# EAGLE design freeduino_V1.16-0603-WestfW (EAGLE 4.16)
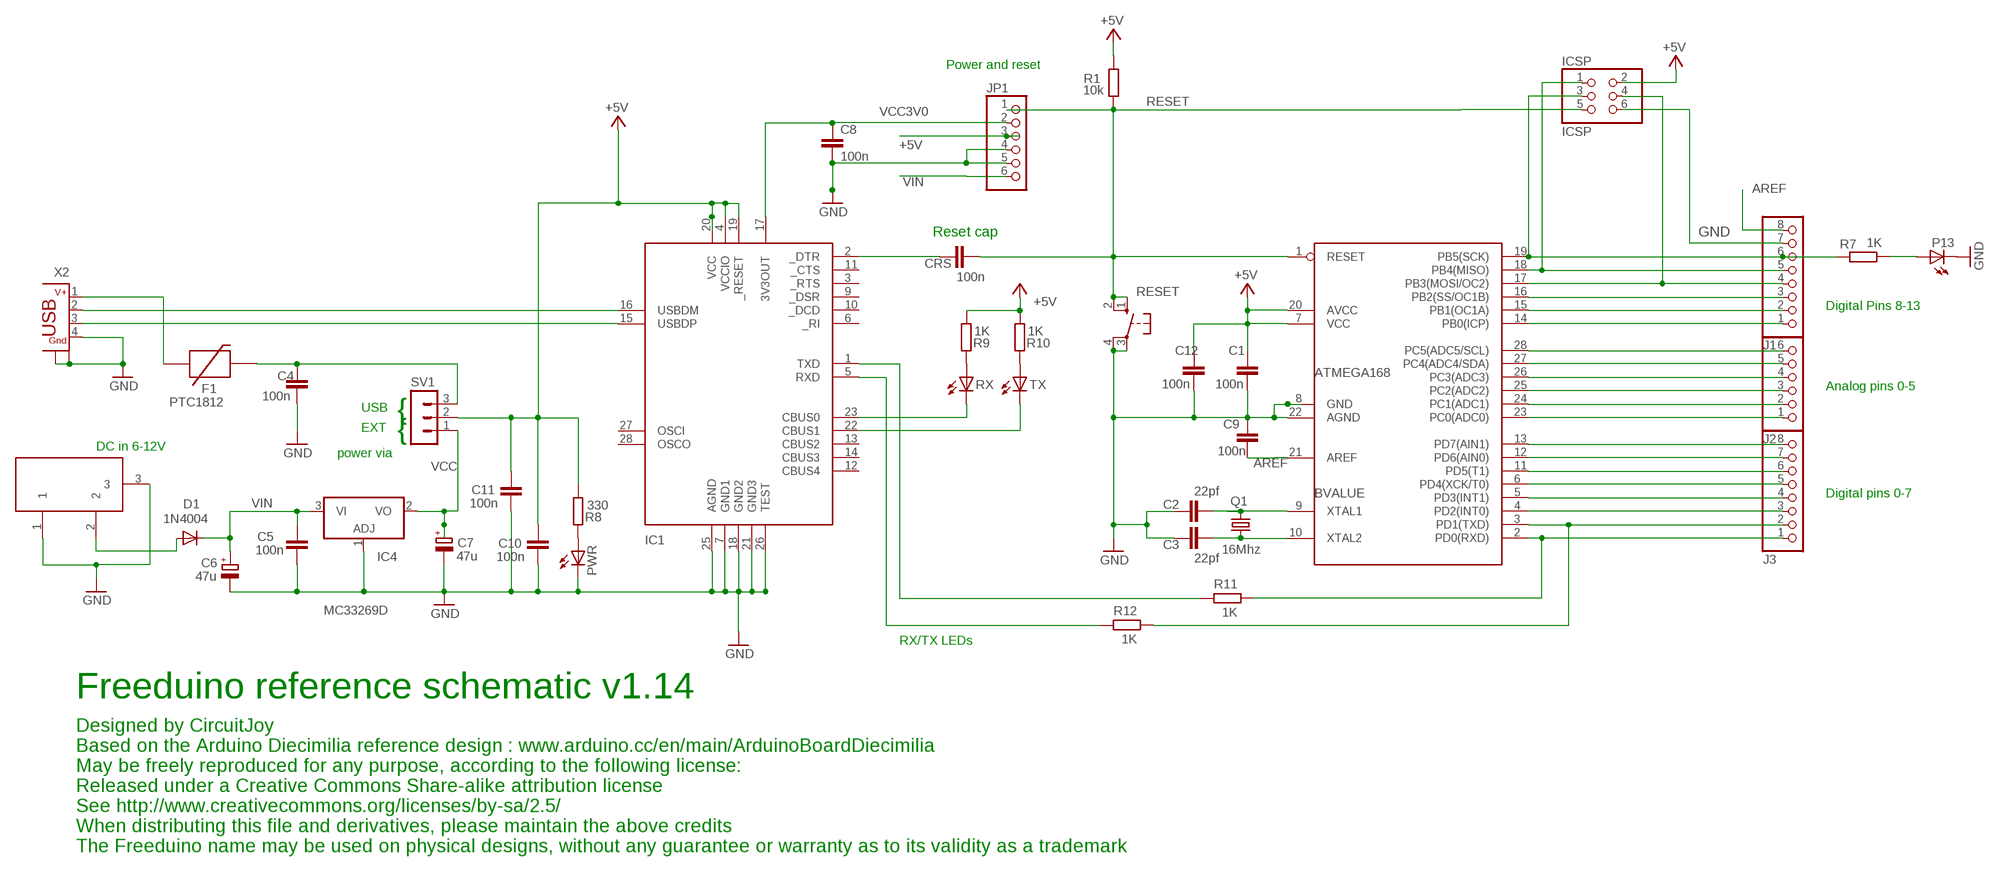
[diagram p0: schematic, sheet 1]

## Parts
BVALUE  ATMEGA168  MEGA8-P  [DIL28-3]
C1  100n  C-EUC0603  [C0603]
C2  22pf  C-EUC0603  [C0603]
C3  22pf  C-EUC0603  [C0603]
C4  100n  C-EUC0603  [C0603]
C5  100n  C-EUC0603  [C0603]
C6  47u  CPOL-EUD  [PANASONIC_D]
C7  47u  CPOL-EUD  [PANASONIC_D]
C8  100n  C-EUC0603  [C0603]
C9  100n  C-EUC0603  [C0603]
C10  100n  C-EUC0603  [C0603]
C11  100n  C-EUC1206  [C1206]
C12  100n  C-EUC0603  [C0603]
CRS  100n  C-EUC0603  [C0603]
D1  1N4004  DIODESMA  [SMA-DIODE]
DC1  9V in  DC21MMX  [DC-21MM]
F1  PTC1812  [C1812]
IC1  FT232RL  FT232RL-PINNED  [SSOP28DB]
IC4  MC33269D  [DPACK]
ICSP  ICSP  PINHD-2X3  [2X03]
J1  PINHD-1X8  [1X08]
J2  PINHD-1X6  [1X06]
J3  PINHD-1X8  [1X08]
JP1  PINHD-1X6  [1X06]
P13  LEDCHIPLED_0603  [CHIPLED_0603]
PWR  LEDCHIPLED_0603  [CHIPLED_0603]
Q1  16Mhz  CRYSTALHC49U-V  [HC49U-V]
R1  10k  R-EU_R0603  [R0603]
R7  1K  R-EU_R0603  [R0603]
R8  330  R-EU_R0603  [R0603]
R9  1K  R-EU_R0603  [R0603]
R10  1K  R-EU_R0603  [R0603]
R11  1K  R-EU_R0603  [R0603]
R12  1K  R-EU_R0603  [R0603]
RESET  10-XX  [B3F-10XX]
RX  LEDCHIPLED_0603  [CHIPLED_0603]
SV1  MA03-1  [MA03-1]
TX  LEDCHIPLED_0603  [CHIPLED_0603]
X2  CON-USB-B  [USB-WSHIELDPADS]

## Nets
+5V [power]: BVALUE.7(VCC) BVALUE.20(AVCC) C1.1 C10.2 C11.2 C12.1 IC1.4(VCCIO) IC1.19(_RESET) IC1.20(VCC) ICSP.2 JP1.3 R1.2 R8.1 R9.1 R10.1 SV1.2
AREF: BVALUE.21(AREF) C9.1 J1.8
GND [power]: BVALUE.8(GND) BVALUE.22(AGND) C1.2 C2.1 C3.1 C4.1 C5.1 C6.- C7.- C8.2 C9.2 C10.1 C11.1 C12.2 DC1.1 DC1.3 IC1.7(GND1) IC1.18(GND2) IC1.21(GND3) IC1.25(AGND) IC1.26(TEST) IC4.1(ADJ) ICSP.6 J1.7 JP1.4 JP1.5 P13.C PWR.C RESET.3(P) RESET.4(P1) X2.4 X2.SH1(GND) X2.SH2(GND)
M8RXD [finepitch]: IC1.1(TXD) R11.1
M8TXD [finepitch]: IC1.5(RXD) R12.1
N$2: BVALUE.15(PB1(OC1A)) J1.2
N$3: PWR.A R8.2
N$5 [finepitch]: IC1.23(CBUS0) RX.C
N$6: BVALUE.9(XTAL1) C2.2 Q1.2
N$7 [power]: C4.2 F1.2 SV1.3
N$8: D1.A DC1.2
N$9 [finepitch]: IC1.16(USBDM) X2.2
N$10: BVALUE.4(PD2(INT0)) J3.3
N$11: BVALUE.5(PD3(INT1)) J3.4
N$12: BVALUE.6(PD4(XCK/T0)) J3.5
N$13: BVALUE.11(PD5(T1)) J3.6
N$14: BVALUE.12(PD6(AIN0)) J3.7
N$15: BVALUE.13(PD7(AIN1)) J3.8
N$16: BVALUE.23(PC0(ADC0)) J2.1
N$17: BVALUE.24(PC1(ADC1)) J2.2
N$18: BVALUE.25(PC2(ADC2)) J2.3
N$19: BVALUE.26(PC3(ADC3)) J2.4
N$20: BVALUE.27(PC4(ADC4/SDA)) J2.5
N$21: BVALUE.28(PC5(ADC5/SCL)) J2.6
N$22: BVALUE.3(PD1(TXD)) J3.2 R12.2
N$23: BVALUE.16(PB2(SS/OC1B)) J1.3
N$24 [finepitch]: IC1.15(USBDP) X2.3
N$26: BVALUE.18(PB4(MISO)) ICSP.1 J1.5
N$27 [power]: F1.1 X2.1
N$28: BVALUE.14(PB0(ICP)) J1.1
N$29 [finepitch]: IC1.22(CBUS1) TX.C
N$31: BVALUE.10(XTAL2) C3.2 Q1.1
N$32: P13.A R7.1
N$34: R10.2 TX.A
N$36: R9.2 RX.A
N$37 [finepitch]: CRS.1 IC1.2(_DTR)
N$43: BVALUE.17(PB3(MOSI/OC2)) ICSP.4 J1.4
N$44: BVALUE.2(PD0(RXD)) J3.1 R11.2
RESET: BVALUE.1(RESET) CRS.2 ICSP.5 JP1.1 R1.1 RESET.1(S) RESET.2(S1)
SCK: BVALUE.19(PB5(SCK)) ICSP.3 J1.6 R7.2
VCC [power]: C7.+ IC4.2(VO) SV1.1
VCC3V0 [power]: C8.1 IC1.17(3V3OUT) JP1.2
VIN [power]: C5.2 C6.+ D1.C IC4.3(VI) JP1.6
Unconnected: IC1.3(_RTS) IC1.6(_RI) IC1.9(_DSR) IC1.10(_DCD) IC1.11(_CTS) IC1.12(CBUS4) IC1.13(CBUS2) IC1.14(CBUS3) IC1.27(OSCI) IC1.28(OSCO)

## Notes on the sheet
- Power and reset
- Reset cap
- Digital Pins 8-13
- Analog pins 0-5
- USB
- {
- EXT
- {
- DC in 6-12V
- power via
- Digital pins 0-7
- RX/TX LEDs
- Freeduino reference schematic v1.14
- Designed by CircuitJoy
- Based on the Arduino Diecimilia reference design : www.arduino.cc/en/main/ArduinoBoardDiecimilia
- May be freely reproduced for any purpose, according to the following license:
- Released under a Creative Commons Share-alike attribution license
- See http://www.creativecommons.org/licenses/by-sa/2.5/
- When distributing this file and derivatives, please maintain the above credits
- The Freeduino name may be used on physical designs, without any guarantee or warranty as to its validity as a trademark

## Library data of the parts
BVALUE = my-library:MEGA8-P: MICROCONTROLLER 8 Kbytes FLASH 1 kbytes SRAM 512 bytes EEPROM USART 4-channel 10 bit ADC 2-channel 8 bit ADC Source: avr.lbr
C1-C5 C8-C12 CRS = rcl:C-EU: CAPACITOR, European symbol
C6 C7 = rcl:CPOL-EU: POLARIZED CAPACITOR, European symbol
D1 = SparkFunEagle-6-6-07:DIODE: Diode These are standard reverse protection diodes and small signal diodes. SMA package can handle up to about 1A. SOD-323 can handle about 200mA. What the SOD-323 package when ordering, there are some mfgs out there that are 5-pin packages.
DC1 = powersupply:DC21MM
F1 = SparkFunEagle-6-6-07:PTC: Resettable Fuse PTC Resettable Fuse. Spark Fun Electronics SKU : COM-08357
IC1 = my-library:FT232RL-PINNED: USB UART FT232RL 4th Generation USB UART (USB <-> Serial) Controller. Spark Fun Electronics SKU : COM-00650
IC4 = linear:MC33269?*: Adjustable Output Low Dropout Voltage Regulator 800 mA Source: http://www.onsemi.com/pub/Collateral/MC33269-D.PDF
ICSP = pinhead:PINHD-2X3: PIN HEADER
J1 J3 = pinhead:PINHD-1X8: PIN HEADER
J2 JP1 = pinhead:PINHD-1X6: PIN HEADER
P13 PWR RX TX = led:LED: LED OSRAM: - CHIPLED LG R971, LG N971, LY N971, LG Q971, LY Q971, LO R971, LY R971 LH N974, LH R974 LS Q976, LO Q976, LY Q976 LO Q996 - Hyper CHIPLED LW Q18S LB Q993, LB Q99A, LB R99A - SideLED LS A670, LO A670, LY A670, LG A670, LP A670 LB A673, LV A673, LT A673, LW A673 LH A674 LY A675 LS A676, LA A676, LO A676, LY A676, LW A676 LS A679, LY A679, LG A679 - Hyper Micro SIDELED® LS Y876, LA Y876, LO Y876, LY Y876 LT Y87S - SmartLED LW L88C, LW L88S LB L89C, LB L89S, LG L890 LS L89K, LO L89K, LY L89K LS L896, LA L896, LO L896, LY L896 - TOPLED LS T670, LO T670, LY T670, LG T670, LP T670 LSG T670, LSP T670, LSY T670, LOP T670, LYG T670 LG T671, LOG T671, LSG T671 LB T673, LV T673, LT T673, LW T673 LH T674 LS T676, LA T676, LO T676, LY T676, LB T676, LH T676, LSB T676, LW T676 LB T67C, LV T67C, LT T67C, LS T67K, LO T67K, LY T67K, LW E67C LS E67B, LA E67B, LO E67B, LY E67B, LB E67C, LV E67C, LT E67C LW T67C LS T679, LY T679, LG T679 LS T770, LO T770, LY T770, LG T770, LP T770 LB T773, LV T773, LT T773, LW T773 LH T774 LS E675, LA E675, LY E675, LS T675 LS T776, LA T776, LO T776, LY T776, LB T776 LHGB T686 LT T68C, LB T68C - Hyper Mini TOPLED® LB M676 - Mini TOPLED Santana® LG M470 LS M47K, LO M47K, LY M47K Source: http://www.osram.convergy.de/
Q1 = crystal:CRYSTAL: CRYSTAL
R1 R7-R12 = rcl:R-EU_: RESISTOR, European symbol
RESET = switch-omron:10-XX: OMRON SWITCH
SV1 = con-lstb:MA03-1: PIN HEADER
X2 = mylib4:CON-USB-B: BERG USB connector

## Net classes
0 default: width 0.254 mm, drill 0.203 mm
1 power: width 0.508 mm, drill 0.305 mm
2 finepitch: width 0.203 mm, drill 0.203 mm

## Board
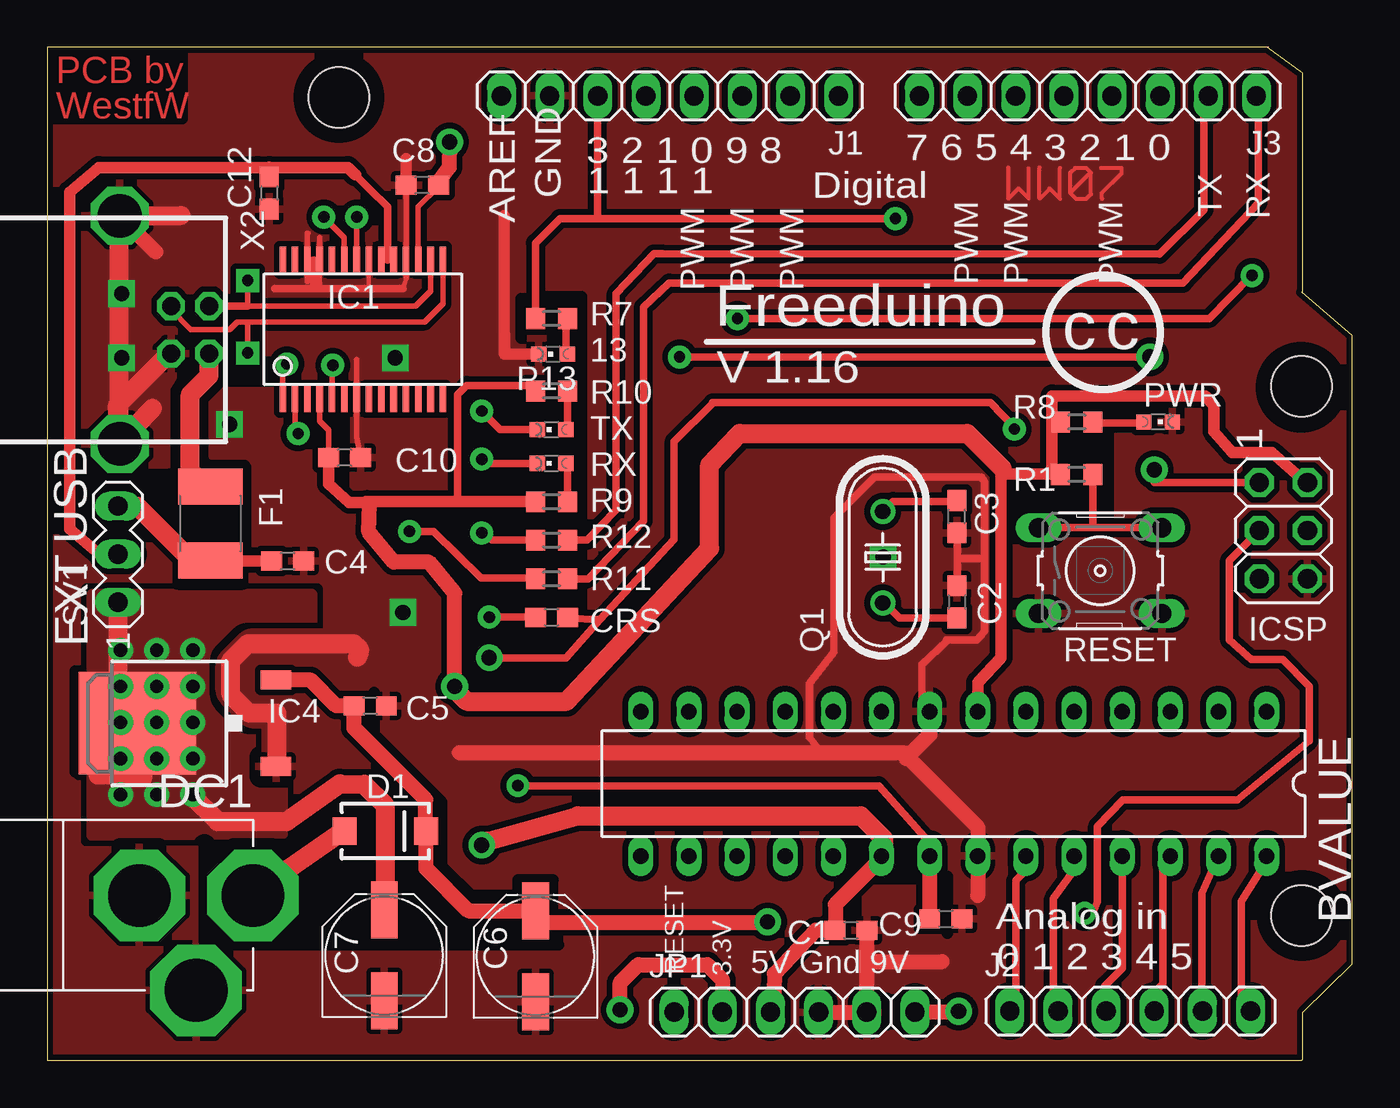
[diagram p1: board, top side]
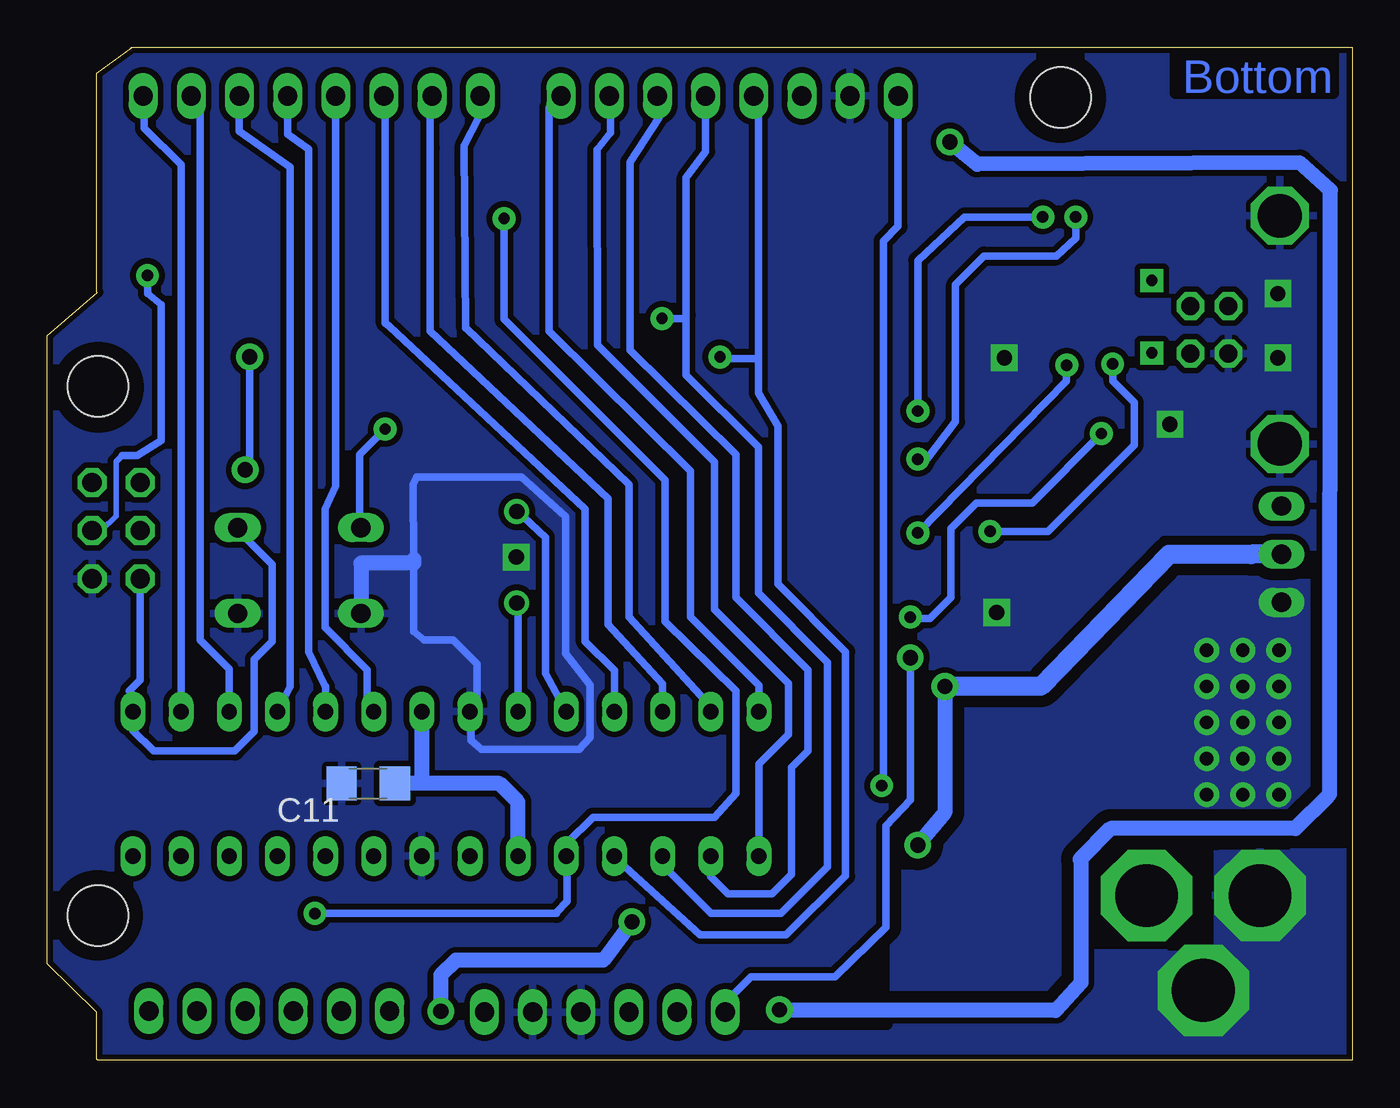
[diagram p2: board, bottom side, seen from below]

Size 68.83 x 53.43 mm. Coordinates in mm from the lower left corner, seen from the top.
Outline: 66.2,0.04 66.22,0.05 66.22,2.54 68.83,5.09
Outline: 66.22,40.53 66.22,52.08 64.39,53.43
Outline: 66.21,0.05 66.18,0 63.63,0 0,0 0,53.43 64.44,53.43
Outline: 68.83,5.1 68.83,38.23 66.17,40.53
Copper layers (1*16): Top 0.035mm / dielectric 1.5mm / Bottom 0.035mm
Design rules "default": minimum track width 10mil, minimum drill 0.6mm, track to track 8mil, track to pad 8mil, pad to pad 8mil, via to via 12mil, smd to smd 8mil, copper to edge 10mil, drill to drill 15mil, minimum pad ring 10mil, minimum via ring 12mil, stop-mask expansion 4mil, vias tented up to drill 0mil, thermal gap 10mil
Holes 3.2 mm at 66.17,35.56 66.17,7.62 15.37,50.8
tRestrict: area 64.2,33.5 to 68.1,37.5; area 64.2,5.6 to 68.2,9.6; area 13.4,48.8 to 17.4,52.8; 35 lines
bRestrict: area 64.2,5.7 to 68.2,9.6; area 64.1,33.5 to 68.1,37.5; area 13.4,48.8 to 17.4,52.8; area 13.4,48.8 to 17.4,52.8; 6 lines

### Footprints (pad centres in the part's own frame; a part is rotated, then mirrored left to right if it is on the bottom)
DIL28-3 = drill 0.813 long: 1 -16.51,-3.81; 2 -13.97,-3.81; 3 -11.43,-3.81; 4 -8.89,-3.81; 5 -6.35,-3.81; 6 -3.81,-3.81; 7 -1.27,-3.81; 8 1.27,-3.81; 9 3.81,-3.81; 10 6.35,-3.81; 11 8.89,-3.81; 12 11.43,-3.81; 13 13.97,-3.81; 14 16.51,-3.81; 15 16.51,3.81; 16 13.97,3.81; 17 11.43,3.81; 18 8.89,3.81; 19 6.35,3.81; 20 3.81,3.81; 21 1.27,3.81; 22 -1.27,3.81; 23 -3.81,3.81; 24 -6.35,3.81; 25 -8.89,3.81; 26 -11.43,3.81; 27 -13.97,3.81; 28 -16.51,3.81
C0603 = smd 1.1 x 1: 1 -0.85,0; 2 0.85,0
PANASONIC_D = smd 3 x 1.4: + 2.4,0; - -2.4,0
C1206 = smd 1.6 x 1.8: 1 -1.4,0; 2 1.4,0
SMA-DIODE = smd 1.27 x 1.47: A -2.15,0; C 2.15,0
DC-21MM = drill 3.302 pad 4.826 octagon: 1 -5.08,-3.353; 2 -0.076,-6.35; 3 -0.076,-0.356
C1812 = smd 1.9 x 3.4: 1 -1.95,0; 2 1.95,0
SSOP28DB = smd 0.348 x 1.397: 1 -4.225,-3.656; 2 -3.575,-3.656; 3 -2.925,-3.656; 4 -2.275,-3.656; 5 -1.625,-3.656; 6 -0.975,-3.656; 7 -0.325,-3.656; 8 0.325,-3.656; 9 0.975,-3.656; 10 1.625,-3.656; 11 2.275,-3.656; 12 2.925,-3.656; 13 3.575,-3.656; 14 4.225,-3.656; 15 4.225,3.656; 16 3.575,3.656; 17 2.925,3.656; 18 2.275,3.656; 19 1.625,3.656; 20 0.975,3.656; 21 0.325,3.656; 22 -0.325,3.656; 23 -0.975,3.656; 24 -1.625,3.656; 25 -2.275,3.656; 26 -2.925,3.656; 27 -3.575,3.656; 28 -4.225,3.656
DPACK = smd 1 x 1.6: 1 -2.28,-4.8; 3 2.28,-4.8 | smd 5.4 x 6.2: 2 0,2.5
2X03 = drill 1.016 octagon: 1 -2.54,-1.27; 2 -2.54,1.27; 3 0,-1.27; 4 0,1.27; 5 2.54,-1.27; 6 2.54,1.27
1X08 = drill 1.016 long: 1 -8.89,0; 2 -6.35,0; 3 -3.81,0; 4 -1.27,0; 5 1.27,0; 6 3.81,0; 7 6.35,0; 8 8.89,0
1X06 = drill 1.016 long: 1 -6.35,0; 2 -3.81,0; 3 -1.27,0; 4 1.27,0; 5 3.81,0; 6 6.35,0
CHIPLED_0603 = smd 0.8 x 0.8: A 0,-0.75; C 0,0.75
HC49U-V = drill 0.813 round: 1 -2.413,0; 2 2.413,0
R0603 = smd 1 x 1.1: 1 -0.85,0; 2 0.85,0
B3F-10XX = drill 1.016 long: 1 -3.251,2.261; 2 3.251,2.261; 3 -3.251,-2.261; 4 3.251,-2.261
MA03-1 = drill 1.016 long: 1 -2.54,0; 2 0,0; 3 2.54,0
USB-WSHIELDPADS = drill 0.95 octagon: 1 1.25,4.71; 2 -1.25,4.71; 3 -1.25,2.71; 4 1.25,2.71 | drill 2.3 octagon: SH1 -6.02,0; SH2 6.02,0

### Placement (x,y rotation side)
BVALUE  47.81,14.58 180 top
C1  42.39,6.86 0 top
C2  47.97,24.18 270 top
C3  47.98,28.67 90 top
C4  12.67,26.33 180 top
C5  17.03,18.7 180 top
C6  25.75,5.48 90 top
C7  17.77,5.52 90 top
C8  19.78,46.16 180 top
C9  47.39,7.46 0 top
C10  15.68,31.79 180 top
C11  51.9,14.6 0 bottom
C12  11.7,45.75 270 top
CRS  26.59,23.37 0 top
D1  17.82,12.09 0 top
DC1  4.49,8.76 90 top
F1  8.6,28.31 270 top
IC1  16.64,38.56 0 top
IC4  7.26,17.77 90 top
ICSP  65.2,27.94 270 top
J1  32.84,50.87 180 top
J2  57.12,2.59 0 top
J3  54.89,50.87 180 top
JP1  39.42,2.54 0 top
P13  26.67,37.26 90 top
PWR  58.59,33.67 270 top
Q1  44.07,26.53 270 top
R1  54.3,30.91 180 top
R7  26.59,39.13 180 top
R8  54.3,33.67 0 top
R9  26.59,29.46 0 top
R10  26.59,35.3 0 top
R11  26.59,25.4 0 top
R12  26.59,27.43 0 top
RESET  55.54,25.83 0 top
RX  26.59,31.49 90 top
SV1  3.72,26.69 90 top
TX  26.59,33.27 90 top
U$3  [CC-LOGO]  56.58,39 0 top
X2  3.81,38.53 270 top

### Tracks (layer width: path | path; a pad name or v marks a point on that pad's centre or on a via)
+5V  (via drill 0.8)
  Top 0.25: 17.95,42.22 18.2,42.22 18.23,42.25 IC1.19 17.95,42.22 | 17.95,42.22 IC1.20 | 17.04,45.91
  Top 0.3: IC1.4 14.36,33.71 14.85,33.23 14.85,31.72 14.83,31.73 C10.2 14.87,31.79 14.93,31.74 14.83,31.74
  Top 0.4: R10.1 25.77,35.3 25.47,35.6 22.12,35.6 21.64,35.12 21.64,29.48 21.72,29.56 22.12,29.56 22.12,29.46 | 17.95,42.22 17.95,45.04 17.04,45.91 16.24,46.71
  Top 0.6: 16.25,46.71 16.24,46.71 15.86,47.09 11.7,47.09 | 16.92,29.46 16.8,29.46 | 16.92,29.46 22.12,29.46 R9.1 | 49.08,19.77 BVALUE.7 | 49.08,19.77 49.08,19.93 50.31,21.23 50.31,30.91 | 52.99,30.91 53.18,30.91 | 52.99,30.91 52.99,33.77 | 52.99,33.77 52.99,35.04 61.08,35.04 61.54,34.57 61.54,33.17 62.5,32.06 64.6,32.06 65.89,30.92 ICSP.2 | R8.1 53.35,33.77 52.99,33.77 | 53.18,30.91 53.19,30.91 | 53.18,30.91 53.01,31.08 | 49.08,19.77 49.08,19.75 | 50.37,31.22 50.31,30.91 | 50.31,30.91 52.99,30.91 | 52.99,30.91 R1.2 | 11.1,47.09 11.7,47.09 | 11.1,47.09 11.08,47.09 11.07,47.08 | 14.83,31.82 14.83,31.74 14.83,30.4 15.92,29.43 16.94,29.43 | 16.92,29.46 16.92,29.47 16.94,29.43 | 17,29.31 16.94,29.37 16.94,29.43 | 17,29.35 17,29.31 | 17,29.31 | 11.7,47.09 11.7,47.11 C12.1 | 11.1,47.09 2.72,47.09 1.17,45.8 1.17,28.01 2.74,26.7 3.67,26.7 3.72,26.65 | 3.72,26.65 3.73,26.64 | SV1.2 3.72,26.65
  Top 0.8: JP1.3 38.15,2.5 38.31,2.65 38.35,4.56 40.53,6.86 C1.1 41.54,6.89 41.4,7.02 41.56,7.18 41.56,8.21 44,10.65 BVALUE.20 44,10.8 44.1,10.91 | 17,29.35 16.96,27.87 18.27,26.28 18.29,26.27 20.13,26.27 21.48,24.64 v21.48,19.72 21.48,19.56 | R1.2
  Top 1: v22.91,11.35 23.19,11.54 27.99,12.89 42.91,12.89 44.1,11.7 44.1,10.91 | 21.48,19.56 22.12,18.93 27.4,18.93 34.93,27 34.93,31.4 36.52,33.07 48.52,33.07 50.37,31.22
  Bottom 0.8: v22.91,11.35 v22.92,11.35 21.48,13.05 v21.48,19.72 | C11.2 44.98,14.6 44,13.61 44,10.79 43.97,10.77 | 43.97,10.77 43.96,10.75 | BVALUE.20 43.97,10.77 | BVALUE.7 49.08,14.61
  Bottom 1: v21.48,19.72 21.46,19.72 21.45,19.73 16.42,19.73 9.66,26.69 5.34,26.68 5.33,26.67 5.31,26.69 SV1.2
AREF  (via drill 0.6)
  Top 0.4: v24.82,14.48 43.87,14.48 46.48,11.54 46.48,10.75 46.54,10.7 | 46.54,10.7 46.56,10.67 | 46.54,10.7 BVALUE.21
  Top 0.8: 46.54,10.89 46.54,10.88 BVALUE.21 | 46.54,10.89 C9.1 | 46.54,10.89 46.56,10.91
  Bottom 0.4: J1.8 23.95,44 24.74,43.22 24.74,14.56 v24.82,14.48 | v24.82,14.48 24.97,14.56 | v24.82,14.48
GND  (via drill 0.8)
  Top 0.2: 50.69,47.11 50.69,45.47 50.72,45.47 51.23,45.98 51.25,45.98 51.77,45.46 51.77,47.06 | 52.33,47.09 52.33,45.46 52.34,45.46 52.36,45.46 52.88,45.98 53.41,45.44 53.41,47.06 53.42,47.07 | 53.97,46.82 54.22,47.07 54.8,47.07 55.05,46.82 55.05,45.69 55.04,45.69 54.8,45.44 54.29,45.44 54.28,45.43 54.27,45.43 53.96,45.74 53.96,46.82 | 53.96,45.76 55.03,46.83 | 55.58,47.07 56.67,47.07 56.67,46.79 55.64,45.76 55.64,45.45 55.65,45.44
  Top 0.25: IC1.7 16.31,35.08 16.31,35.09 | 13.71,42.24 13.71,42.25 | 13.71,42.24 IC1.26 14.05,42.22 | 14.05,42.22 13.74,42.22 13.71,42.24 | 14.05,42.22 14.34,42.22 IC1.25 | 18.78,40.7 18.91,41.23 | IC1.21 16.96,40.7 | 18.91,46.18 C8.2 18.88,46.16 18.85,46.13 18.91,46.06 18.91,46.18 | 18.91,46.18 18.86,46.23 | 14.36,43.39 14.34,43.39 | 13.71,43.63 13.79,43.63
  Top 0.3: C10.1 16.3,32.87 16.31,32.88 16.31,35.09 | IC1.7 16.31,36.96 | 18.91,41.23 IC1.18 18.91,46.06 | IC1.25 14.36,43.39 | 13.71,43.63 IC1.26 13.71,41.08 13.73,41.08 | 14.34,42.22 14.34,41 14.35,41
  Top 0.4: 11.98,40.7 14.05,40.7 | 14.05,40.7 16.96,40.7 18.78,40.7 | 14.05,40.7 14.05,42.22 | C3.1 48.01,27.66 47.99,27.66 47.99,25.05 | 47.99,25.05 C2.1 | 49.42,26.47 49.42,30.52 49.26,30.75 43.63,30.75 41.48,28.61 41.48,21.55 40.21,19.88 40.21,17.02 40.69,16.39 45.85,16.39 | 49.42,26.47 49.42,22.62 49.02,22.18 47.44,22.18 47.44,22.09 46.14,20.88 46.14,18.97 46.53,18.39 BVALUE.8 | 45.85,16.39 46.01,16.39 46.56,16.94 46.56,18.29 46.56,18.45 | 47.99,25.05 47.99,26.47 49.42,26.47 | 45.77,16.55 45.85,16.55 45.85,16.39
  Top 0.6: P13.C 24.11,37.26 24.1,39.48 24.1,44.56 | 18.91,46.06 18.91,47.55 | JP1.5 43.35,2.54
  Top 0.8: 49.08,8.69 BVALUE.22 49.08,12.29 45.37,15.99 | 44.5,5.19 43.23,5.27 43.23,5.19 | 44.5,5.19 47.2,5.19 | 43.23,5.19 43.23,2.65 43.31,2.58 43.27,2.54 JP1.5 43.11,2.54 43.07,2.58 43.03,2.54 JP1.4 | 43.23,5.19 44.5,5.19 | C1.2 43.24,6.38 43.23,5.19 | 21.72,16.23 45.14,16.23 45.37,15.99 | 45.37,15.99 45.29,15.91 | 45.37,15.99 | 46.56,18.29 46.56,17.18 45.37,15.99 | 3.79,44.56 5.73,42.63
  Top 1: 6.49,37.32 6.48,37.33 3.69,34.54 3.81,32.58 | X2.SH2 3.81,32.58 | 3.79,32.57 3.79,44.56 | 3.79,44.56 3.67,44.56 | 3.79,44.56 7.04,44.56 | 16.34,21.26 16.46,21.58 16.46,21.68 16.16,21.98 10.58,21.98 9.67,21.06 9.67,19.27 10.64,18.3 12.12,18.3 12.12,15.49 IC4.1 | 3.81,32.58 5.55,34.39
  Bottom 0.4: BVALUE.8 46.54,18.64 46.17,19.01 46.17,20.91 47.44,22.18 48.95,22.18 49.5,22.62 49.5,26.44 49.54,30.36 49.34,30.75 43.83,30.75 41.48,28.69 41.48,21.47 40.21,19.8 40.21,17.02 40.77,16.39 45.93,16.39 46.48,16.86 46.48,18.29 46.56,18.37 46.72,18.37
  Bottom 0.8: RESET.3 52.29,26.23 49.5,26.23 49.5,26.44
  other vias: 44.09,26.54 3.91,40.44 3.91,37.05 18.75,23.61 18.35,37.05 9.61,33.55
  pour Top (isolate 0.305, rank 4): -0.9,54.8 -0.9,-1 70.46,-1 70.46,54.57 -0.9,54.57
  pour Bottom (isolate 0.305, rank 4): -7.05,54.37 -7.01,-0.44 69.82,-0.44 69.82,54.57 -7.01,54.61
  pour Bottom (isolate 0.4, rank 6, no thermals): -1.81,11.42 14.29,11.42 14.29,-1.51 -1.62,-1.51 -1.62,11.38
M8RXD  (via drill 0.6)
  Top 0.25: 25.69,25.44 25.73,25.4 R11.1
  Top 0.3: IC1.1 12.42,36.4 v12.64,36.73
  Top 0.4: v19.1,27.9 19.58,27.9 20.37,27.9 22.87,25.44 25.69,25.44
  Bottom 0.4: v19.1,27.9 16.06,27.9 11.5,32.45 11.5,34.7 12.62,35.82 12.62,36.68 12.64,36.7 v12.64,36.73
M8TXD  (via drill 0.6)
  Top 0.3: v15.05,36.67 15.07,36.66 15.01,36.61 IC1.5
  Top 0.4: R12.1 23.46,27.43 v22.91,27.82
  Bottom 0.4: v22.91,27.82 v22.91,27.81 15.07,35.82 15.07,36.67 v15.05,36.67
N$2
  Bottom 0.4: BVALUE.15 31.3,15.62 29.74,17.18 29.74,19.88 33.63,23.77 33.63,31.55 39.82,37.74 39.84,48.04 39.12,48.93 39.15,50.87 J1.2 39.14,50.87 39.14,50.88
N$3
  Top 0.4: R8.2 55.37,33.61 57.84,33.61 PWR.A
N$5  (via drill 0.6)
  Top 0.25: 25.82,31.47 RX.C | v22.91,31.71 23.15,31.47
  Top 0.3: IC1.23 15.66,43.4 v14.58,44.49
  Top 0.4: 23.15,31.47 25.82,31.47
  Bottom 0.25: v14.58,44.49
  Bottom 0.4: v22.91,31.71 22.43,31.71 20.93,33.69 20.93,40.91 19.42,42.42 15.61,42.42 14.58,43.37 v14.58,44.49
N$6
  Top 0.4: Q1.2 44.07,24.13 44.1,24.17 44.94,23.33 C2.2
  Bottom 0.4: 44.07,24.17 44.1,24.17 | 44.07,24.17 Q1.2 | BVALUE.9 44,24.17 44.07,24.17
N$7
  Top 0.6: F1.2 8.63,26.37 8.67,26.32 8.68,26.33 C4.2
  Top 1: 3.42,29.07 3.58,29.23 SV1.3 4.75,29.23 7.6,26.38 8.53,26.38 8.55,26.37 F1.2
N$8
  Top 1: D1.A 15.59,12.09 10.84,8.81 DC1.2
N$9  (via drill 0.6)
  Top 0.3: 18.59,39.78 10.56,39.78 v10.56,41.14 | 18.59,39.78 18.67,39.78 | IC1.16 20.21,40.57 19.42,39.78 18.59,39.78
  Top 0.4: 8.44,39.78 8.41,39.8 | X2.2 8.44,39.78 | 10.56,39.78 8.44,39.78
N$10
  Bottom 0.4: J3.3 58.7,49 56.01,47.1 56.01,19.72 56.67,18.41 56.66,18.42 56.64,18.43 BVALUE.4
N$11
  Bottom 0.4: J3.4 56.16,48.84 55.06,48.06 55.05,21.54 54.18,19.72 54.17,19.72 54.16,19.73 54.16,19.72 BVALUE.5
N$12
  Bottom 0.4: J3.5 53.62,30.29 54.18,29.09 54.18,22.82 51.96,20.59 51.96,19.01 51.97,19.01 | 51.97,19.01 51.98,19.01 | BVALUE.6 51.62,18.37 51.97,19.01
N$13
  Bottom 0.4: BVALUE.11 38.92,20.57 40.45,22.1 40.45,29.09 50.81,38.73 51.01,38.89 51.01,50.76 51.08,50.83 J3.6
N$14
  Bottom 0.4: BVALUE.12 36.38,19.85 39.26,22.97 39.26,29.64 48.63,38.45 48.63,48.14 48.63,49.88 48.55,50.91 48.55,50.84 | 48.54,50.91 J3.7 48.54,50.84 48.55,50.84 | 48.55,50.84
N$15
  Bottom 0.4: BVALUE.13 33.84,18.66 38.15,23.37 38.15,30.36 46.76,38.65 46.76,38.61 46.84,48.26 46.09,49.72 46.09,50.68 46.08,50.69 J3.8
N$16
  Top 0.4: BVALUE.23 51.62,10.01 51.09,9.48 51.09,2.97 50.7,2.59 J2.1
  Top 0.8: 50.7,2.59 50.69,2.58
N$17
  Top 0.4: BVALUE.24 54.16,10.01 53.07,8.53 53.07,2.73 53.32,2.59 J2.2
N$18
  Top 0.4: BVALUE.25 56.7,4.85 55.77,3.92 55.77,2.89 55.85,2.81 J2.3
N$19
  Top 0.4: BVALUE.26 58.84,10.37 58.84,4.02 58.36,3.54 58.36,2.58
  Top 0.6: 58.36,2.58 J2.4
N$20
  Top 0.4: BVALUE.27 61.86,10.85 61.54,10.23 60.91,8.8 60.91,2.58
  Top 0.6: 60.91,2.58 J2.5
N$21
  Top 0.4: BVALUE.28 64.32,10.51 62.97,8.37 62.97,2.43 63.45,2.59
  Top 0.6: 63.45,2.59 J2.6
N$22
  Top 0.4: R12.2 28.48,27.43 30.01,29.02 30.01,40.44 31.99,42.54 32.44,42.54 58.66,42.52 61.01,44.85 61.01,50.44 J3.2 61.24,50.84 J3.2
  Bottom 0.4: BVALUE.3 59.24,20.65 60.77,22.18 60.77,50.36 61.29,50.87 | 61.29,50.87 J3.2 | J3.2 61.29,50.87
N$23
  Bottom 0.4: BVALUE.16 33.84,9.69 32.91,8.77 30.61,8.77 29.58,9.8 29.58,15.43 28.7,16.31 28.7,20.59 32.51,24.4 32.51,31.94 38.09,37.46 38.09,47.38 36.56,49.72 36.56,50.68 J1.3
N$24  (via drill 0.6)
  Top 0.3: IC1.15 20.86,39.91 19.9,38.94 10.56,38.94 | 10.56,38.94 10.02,38.94 9.62,38.54 7.55,38.54 6.48,39.66 6.49,39.68 6.49,39.71 | 10.56,38.94 v10.56,37.31
  Top 0.4: 6.49,39.68 6.48,39.68 6.48,39.74 X2.3
N$26  (via drill 0.6, 0.8)
  Top 0.4: ICSP.1 58.39,30.48 v58.39,31.15 | v33.35,37.1 v58.15,37.1
  Bottom 0.4: v58.39,31.15 58.15,31.15 v58.15,37.1 | BVALUE.18 38.92,10.73 34.4,6.62 29.86,6.62 26.72,9.72 26.72,21.55 30.29,25.12 30.29,33.45 31.32,35.2 31.32,37.02 | J1.5 31.52,50.87 31.4,50.76 31.32,50.12 31.32,37.02 | v33.35,37.1 33.55,37.02 31.32,37.02
N$27
  Top 1: X2.1 8.52,36.11 7.54,35.12 7.54,31.08 8.41,30.2 8.47,30.27 F1.1
N$28
  Bottom 0.4: BVALUE.14 31.3,19.77 34.9,23.37 34.9,31.07 42.36,38.47 42.36,50.26 41.73,50.91 | 41.73,50.91 41.72,50.91 | 41.73,50.91 J1.1
N$29  (via drill 0.6)
  Top 0.25: 16.32,42.18 16.31,42.19 IC1.22
  Top 0.3: 16.32,42.18 v16.32,44.49
  Top 0.4: TX.C 23.89,33.27 v22.91,34.25
  Bottom 0.4: v22.91,34.25 22.91,42.18 20.45,44.49 16.48,44.49 v16.32,44.49
N$31
  Top 0.4: 48.21,29.48 48.23,29.48 | 48.21,29.48 C3.2 | Q1.1 44.61,29.48 48.21,29.48
  Bottom 0.4: BVALUE.10 42.56,20.4 42.56,27.58 44.1,29.01 44.1,28.91 Q1.1
N$32
  Top 0.4: R7.1 27.43,39.01 27.36,38.93 27.36,37.19 | 27.36,37.19 27.36,37.18 | P13.A 27.36,37.19
N$34
  Top 0.4: TX.A 27.4,33.21 27.43,33.21 R10.2
N$36
  Top 0.4: R9.2 27.43,31.4 RX.A
N$37  (via drill 0.6)
  Top 0.25: CRS.1 arc-90 CRS.1 | 13.07,35.04 IC1.2
  Top 0.3: v13.23,33.06 13.07,33.35 IC1.2
  Top 0.4: v23.31,23.37 CRS.1
  Bottom 0.4: v13.23,33.06 16.88,29.4 19.81,29.4 21.16,28.05 21.16,24.4 22.28,23.29 23.31,23.29 v23.31,23.37
N$43  (via drill 0.6)
  Top 0.4: v63.55,41.39 v63.55,41.4 63.52,41.4 61.31,39.13 v36.4,39.13
  Bottom 0.3: ICSP.4 65.98,27.94 65.21,28.71 65.21,31.58 64.89,31.9
  Bottom 0.4: BVALUE.17 36.1,10.01 33.82,7.73 30.13,7.73 27.67,10.2 27.67,20.99 31.32,24.64 31.32,32.34 35.13,36.15 35.13,39.33 | J1.4 34.1,47.94 35.13,46.55 35.13,39.33 | 35.13,39.33 | v36.4,39.13 35.15,39.13 35.13,39.33 | 64.89,31.9 64.09,31.9 62.82,32.69 62.82,39.86 63.55,40.43 v63.55,41.4
N$44
  Top 0.4: R11.2 28.51,25.4 31.44,28.45 31.44,39.72 32.79,41 59.9,40.99 63.87,45.22 63.87,50.85 J3.1
  Bottom 0.4: BVALUE.2 61.78,47.24 63.71,49.17 63.71,50.6 63.79,50.68 63.78,50.69 J3.1
RESET  (via drill 0.6, 0.8)
  Top 0.4: CRS.2 27.44,23.3 27.43,23.29 29.14,23.25 | RESET.1 55.22,28.09 | 55.22,28.09 58.44,28.09 58.63,27.9 58.79,28.06 RESET.2 58.87,28.05 | 55.22,28.09 55.22,28.13 55.15,28.2 R1.1 | v23.31,21.23 27.36,21.23 29.14,23.25 | 29.14,23.25 33.06,27.47 33.06,32.65 35.11,34.67 35.1,34.68 49.74,34.68 51.01,33.37 v51.01,33.29
  Bottom 0.4: ICSP.5 63.93,20.05 64.5,19.48 64.32,19.3 BVALUE.1 64.32,17.39 63.23,16.31 58.95,16.31 57.91,17.34 57.91,21.15 56.96,22.1 56.96,26.15 58.79,27.98 RESET.2 | RESET.1 52.34,28.13 52.36,28.13 52.36,31.94 v51.01,33.29 | JP1.1 33.07,3.06 31.72,4.4 27.28,4.4 24.6,7.01 24.6,12.37 23.31,13.73 23.31,21.31 | 23.31,21.31 23.23,21.39 | 23.31,21.31 v23.31,21.23 | 23.31,21.31
SCK  (via drill 0.6)
  Top 0.4: 29.02,50.76 J1.6 | 29.02,50.76 28.94,50.76 | ICSP.3 62.36,26.37 62.36,22.16 63.51,21.15 65.18,21.15 66.57,19.72 66.57,16.85 62.78,13.73 56.74,13.73 55.39,12.34 55.39,8.36 55.09,7.64 v54.72,7.74 | 44.72,44.41 v44.74,44.41 29.02,44.41 | 29.02,44.41 29.02,50.76 | R7.2 25.74,43.11 27.04,44.41 29.02,44.41
  Bottom 0.4: v44.74,44.41 44.74,39.09 36.25,30.59 36.25,23.13 32.51,19.48 32.51,14.08 33.63,12.81 40.06,12.81 41.4,11.47 41.4,10.83 41.46,10.78 BVALUE.19 41.39,10.77 41.4,11.07 41.4,10.75 41.4,8.37 41.97,7.8 41.97,7.74 v54.72,7.74
VCC  (via drill 0.7)
  Top 0.8: 5.05,17.18 4.88,17.01 IC4.2
  Top 1: 3.74,17.21 IC4.2 | SV1.1 3.74,22.86 3.74,17.21 | 3.74,17.21 5.05,14.92 2.67,15.04 | C7.+ 17.77,8.38 17.81,8.4 17.81,13.46 16.71,14.56 15.42,14.58 12.63,12.59 8.98,12.59 7.62,13.96 v7.67,14.01
  other vias: 3.86,21.63 5.77,21.63 3.86,19.72 5.77,19.72 7.67,19.72 5.77,15.91 3.86,17.82 5.77,17.82 3.86,15.91 7.67,17.82 7.67,15.91 5.77,14.01 3.86,14.01 7.67,21.63
  pour Top (isolate 0.61, no thermals): 2.37,24.57 5.48,24.57 5.46,24.57 8.27,24.57 8.29,24.57 13.95,24.57 13.95,21.52 12.38,21.54 12.4,11.94 2.37,11.86
  pour Bottom (isolate 0.61, rank 2, no thermals): 2.36,28.04 2.47,13.37 13.39,13.37 13.6,2.73 23.97,2.67 23.99,21 14.46,21.02 7.03,28.04
VCC3V0  (via drill 0.8)
  Top 0.25: C8.1 20.63,46.09
  Top 0.3: IC1.17 19.56,45.02 20.63,46.09
  Top 0.8: C8.1 20.61,46.18 20.61,46.31 21.2,47.11 v21.22,48.44 | v30.21,2.65 30.21,4.08 31.17,5.04 34.82,5.04 35.61,4.24 35.61,2.73 JP1.2
  Bottom 0.8: v30.21,2.65 30.13,2.5 30.18,2.62 15.63,2.62 14.31,4.09 14.31,10.55 14.34,10.58 14.34,10.62 12.74,12.22 2.99,12.22 1.26,13.95 1.19,14.04 1.14,45.9 2.77,47.34 19.79,47.26 v21.22,48.44
VIN  (via drill 0.8)
  Top 0.8: JP1.6 48.03,2.54 v48.07,2.58 | 19.95,12.11 D1.C 19.97,10.11 22.2,7.88 25.69,7.88 C6.+ | 19.95,12.11 19.97,12.13 | v37.99,7.3 v37.99,7.29 37.99,7.28 26.05,7.28 25.75,6.98 | IC4.3 13.89,20.05 15.24,18.69 16.14,18.69 16.14,18.7 C5.2 16.18,18.6 16.18,18.59 16.18,17.52 19.95,13.75 19.95,12.11
  Top 1: C6.+ 25.75,6.98 25.75,6.9
  Bottom 0.8: v48.07,2.58 48.07,4.48 47.28,5.27 39.5,5.27 v37.99,7.3

### Text on the board
Top: PCB by | WestfW
Bottom: Bottom
tPlace: 13 | USB | EXT | RESET | 3.3V
tNames: 3 2 1 0 9 8 | 7 6 5 4 3 2 1 0 | TX | RX | 1 1 1 1 | GND | PWM | PWM | PWM | Digital | PWM | PWM | PWM | AREF | Freeduino | V 1.16 | 1 | Analog in | 5V Gnd 9V | 0 1 2 3 4 5
Edit History: 20070916 WestfW: Bump Version to 1.16 | 20070916 WestfW: make 0603, 0805, 1206 layouts more alike | 20070912 WestfW: Change fuse to SMT package & reroute | 20070912 WestfW: Change USB connector to include pads for shield | 20070911 WestfW: Now V1.15. Move traces away from mounting holes | 20070910 WestfW: Change power connector (yuck!) | 20070910 WestfW: Fiddle w Silkscreen. Fix Analogin numbering | 20070908 WestfW: Center hole for potential ceramic resonator | 20070908 WestfW: Fix USB connector pinout (sch now 1.14) | 20070906 WestfW: Additional copper for VR heatsink. | 20070906 WestfW: Add in Mounting holes. Additional bypass caps. | 20070904 WestfW: Rotate Crystal for GND Guard Ring, move some caps | 20070903 WestfW: Initial manual Route | 20070900 Daniel: Schematic and initial placement